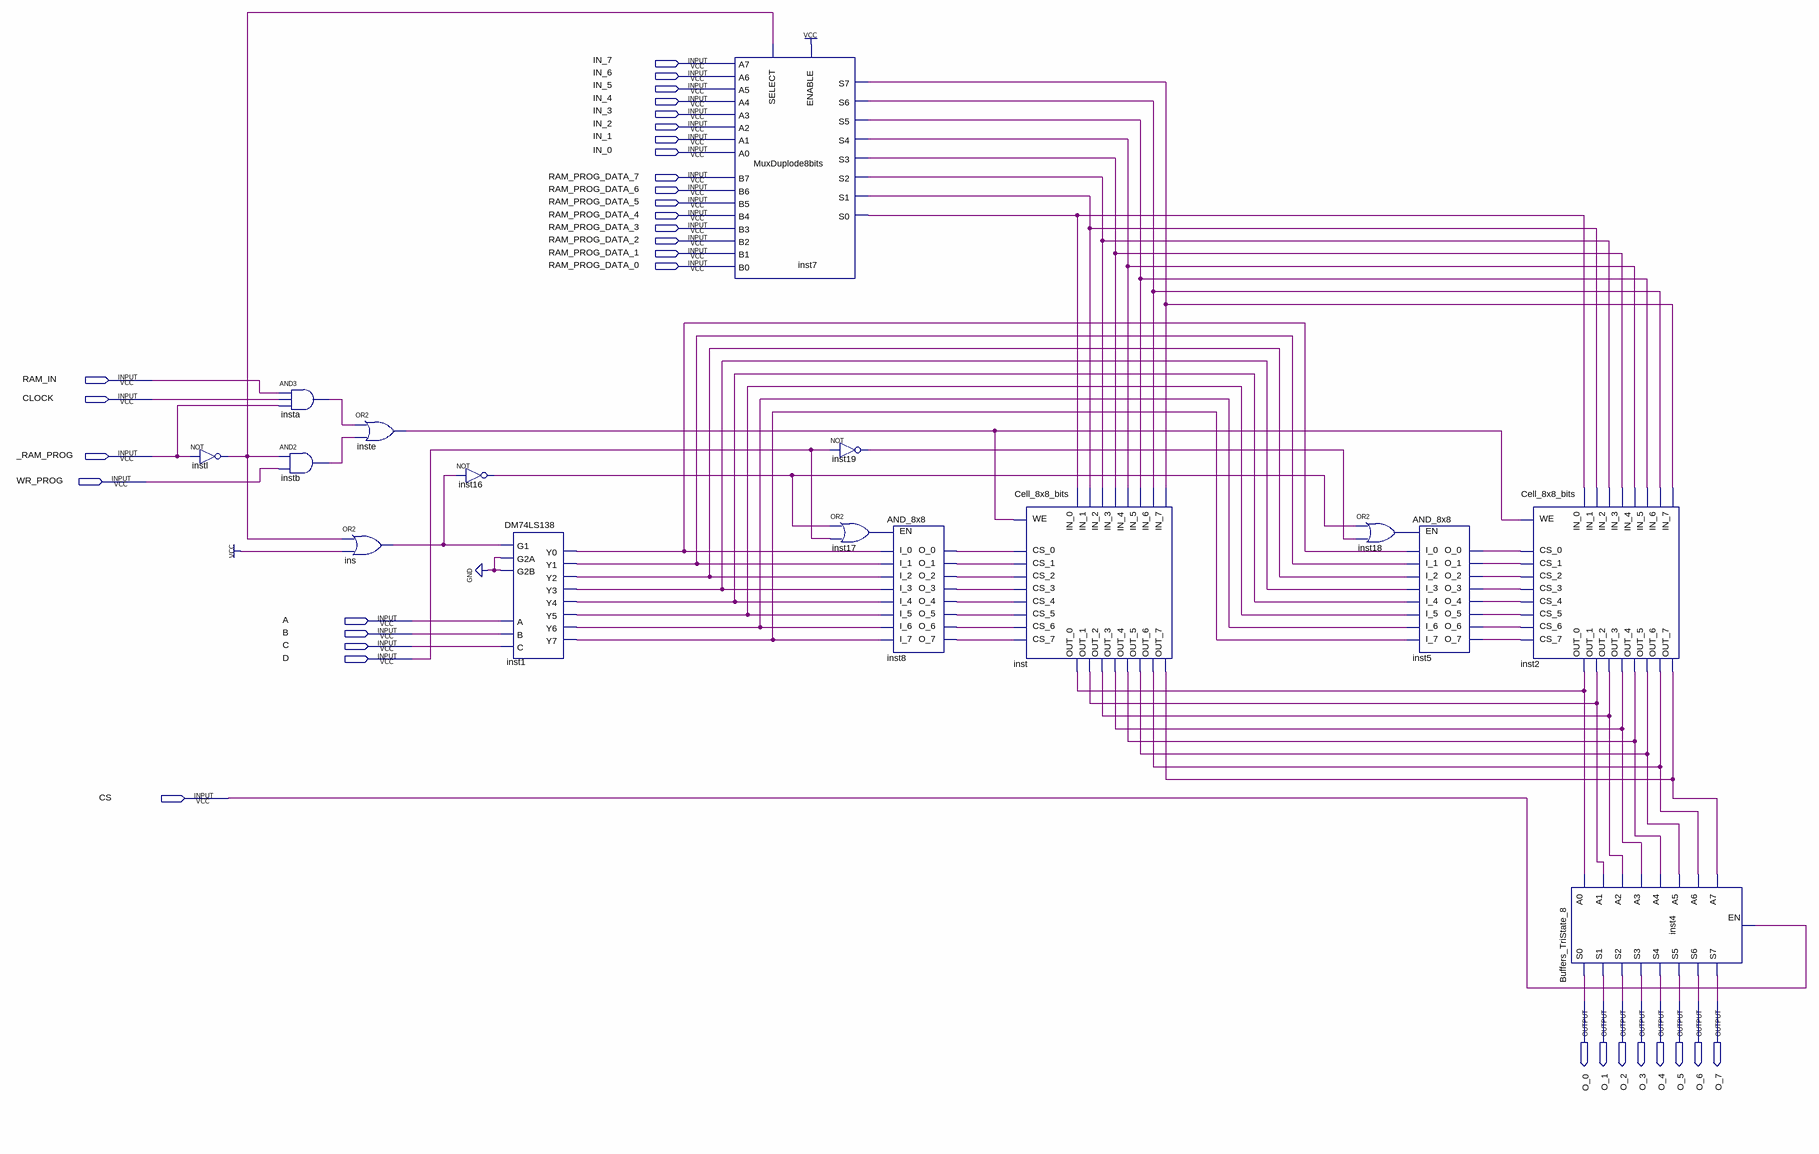
[diagram p0: schematic sheet]
// Quartus schematic RAM.bdf as structural Verilog: 16 symbols, 33 pins
module RAM (
  input  IN_7,
  input  IN_6,
  input  IN_5,
  input  IN_4,
  input  IN_3,
  input  IN_2,
  input  IN_1,
  input  IN_0,
  input  RAM_PROG_DATA_7,
  input  RAM_PROG_DATA_6,
  input  RAM_PROG_DATA_5,
  input  RAM_PROG_DATA_4,
  input  RAM_PROG_DATA_3,
  input  RAM_PROG_DATA_2,
  input  RAM_PROG_DATA_1,
  input  RAM_PROG_DATA_0,
  input  RAM_IN,
  input  CLOCK,
  input  _RAM_PROG,
  input  WR_PROG,
  input  A,
  input  B,
  input  C,
  input  D,
  input  CS,
  output O_0,
  output O_1,
  output O_2,
  output O_3,
  output O_4,
  output O_5,
  output O_6,
  output O_7
);

  wire ins_out, inst1_y0, inst1_y1, inst1_y2, inst1_y3, inst1_y4, inst1_y5, inst1_y6, inst1_y7, inst5_o_0,
       inst5_o_1, inst5_o_2, inst5_o_3, inst5_o_4, inst5_o_5, inst5_o_6, inst5_o_7, inst7_s0, inst7_s1,
       inst7_s2, inst7_s3, inst7_s4, inst7_s5, inst7_s6, inst7_s7, inst8_o_0, inst8_o_1, inst8_o_2,
       inst8_o_3, inst8_o_4, inst8_o_5, inst8_o_6, inst8_o_7, inst16_out, inst17_out, inst18_out, inst19_out,
       inst_out_0, inst_out_1, inst_out_2, inst_out_3, inst_out_4, inst_out_5, inst_out_6, inst_out_7,
       insta_out, instb_out, inste_out, instl_out;

  not instl (instl_out, _RAM_PROG);
  and insta (insta_out, RAM_IN, CLOCK, _RAM_PROG);
  and instb (instb_out, instl_out, WR_PROG);
  or inste (inste_out, insta_out, instb_out);
  or ins (ins_out, instl_out, 1'b1);
  not inst16 (inst16_out, ins_out);
  DM74LS138 inst1 (
    .G1(ins_out), .G2A(1'b0), .G2B(1'b0), .A(A), .B(B), .C(C), .Y0(inst1_y0), .Y1(inst1_y1), .Y2(inst1_y2),
    .Y3(inst1_y3), .Y4(inst1_y4), .Y5(inst1_y5), .Y6(inst1_y6), .Y7(inst1_y7));
  MuxDuplode8bits inst7 (
    .SELECT(instl_out), .ENABLE(1'b1), .A7(IN_7), .B7(RAM_PROG_DATA_7), .A6(IN_6), .B6(RAM_PROG_DATA_6),
    .A5(IN_5), .B5(RAM_PROG_DATA_5), .A4(IN_4), .B4(RAM_PROG_DATA_4), .A3(IN_3), .B3(RAM_PROG_DATA_3),
    .A2(IN_2), .B2(RAM_PROG_DATA_2), .A1(IN_1), .B1(RAM_PROG_DATA_1), .A0(IN_0), .B0(RAM_PROG_DATA_0),
    .S7(inst7_s7), .S6(inst7_s6), .S5(inst7_s5), .S4(inst7_s4), .S3(inst7_s3), .S2(inst7_s2), .S1(inst7_s1),
    .S0(inst7_s0));
  not inst19 (inst19_out, D);
  or inst17 (inst17_out, inst16_out, D);
  AND_8x8 inst8 (
    .EN(inst17_out), .I_0(inst1_y0), .I_1(inst1_y1), .I_2(inst1_y2), .I_3(inst1_y3), .I_4(inst1_y4),
    .I_5(inst1_y5), .I_6(inst1_y6), .I_7(inst1_y7), .O_0(inst8_o_0), .O_1(inst8_o_1), .O_2(inst8_o_2),
    .O_3(inst8_o_3), .O_4(inst8_o_4), .O_5(inst8_o_5), .O_6(inst8_o_6), .O_7(inst8_o_7));
  Cell_8x8_bits inst (
    .IN_0(inst7_s0), .IN_1(inst7_s1), .IN_2(inst7_s2), .IN_3(inst7_s3), .IN_4(inst7_s4), .IN_5(inst7_s5),
    .IN_6(inst7_s6), .IN_7(inst7_s7), .WE(inste_out), .CS_0(inst8_o_0), .CS_1(inst8_o_1), .CS_2(inst8_o_2),
    .CS_3(inst8_o_3), .CS_4(inst8_o_4), .CS_5(inst8_o_5), .CS_6(inst8_o_6), .CS_7(inst8_o_7),
    .OUT_0(inst_out_0), .OUT_1(inst_out_1), .OUT_2(inst_out_2), .OUT_3(inst_out_3), .OUT_4(inst_out_4),
    .OUT_5(inst_out_5), .OUT_6(inst_out_6), .OUT_7(inst_out_7));
  or inst18 (inst18_out, inst16_out, inst19_out);
  AND_8x8 inst5 (
    .EN(inst18_out), .I_0(inst1_y0), .I_1(inst1_y1), .I_2(inst1_y2), .I_3(inst1_y3), .I_4(inst1_y4),
    .I_5(inst1_y5), .I_6(inst1_y6), .I_7(inst1_y7), .O_0(inst5_o_0), .O_1(inst5_o_1), .O_2(inst5_o_2),
    .O_3(inst5_o_3), .O_4(inst5_o_4), .O_5(inst5_o_5), .O_6(inst5_o_6), .O_7(inst5_o_7));
  Cell_8x8_bits inst2 (
    .IN_0(inst7_s0), .IN_1(inst7_s1), .IN_2(inst7_s2), .IN_3(inst7_s3), .IN_4(inst7_s4), .IN_5(inst7_s5),
    .IN_6(inst7_s6), .IN_7(inst7_s7), .WE(inste_out), .CS_0(inst5_o_0), .CS_1(inst5_o_1), .CS_2(inst5_o_2),
    .CS_3(inst5_o_3), .CS_4(inst5_o_4), .CS_5(inst5_o_5), .CS_6(inst5_o_6), .CS_7(inst5_o_7),
    .OUT_0(inst_out_0), .OUT_1(inst_out_1), .OUT_2(inst_out_2), .OUT_3(inst_out_3), .OUT_4(inst_out_4),
    .OUT_5(inst_out_5), .OUT_6(inst_out_6), .OUT_7(inst_out_7));
  Buffers_TriState_8 inst4 (
    .EN(CS), .A7(inst_out_7), .A6(inst_out_6), .A5(inst_out_5), .A4(inst_out_4), .A3(inst_out_3),
    .A2(inst_out_2), .A1(inst_out_1), .A0(inst_out_0), .S7(O_7), .S6(O_6), .S5(O_5), .S4(O_4), .S3(O_3),
    .S2(O_2), .S1(O_1), .S0(O_0));
endmodule
